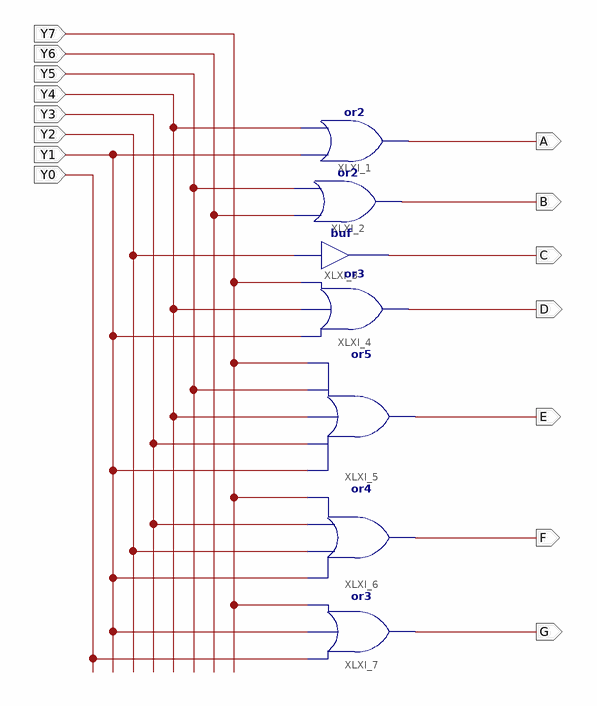
[diagram p0: schematic sheet 1]
// Xilinx ISE schematic seven_segment_decoder.sch (zynq) as structural Verilog: 7 symbols, 15 ports
module seven_segment_decoder (
  input  Y7,
  input  Y6,
  input  Y4,
  input  Y3,
  input  Y2,
  input  Y1,
  input  Y0,
  input  Y5,
  output A,
  output B,
  output C,
  output D,
  output E,
  output F,
  output G
);

  or XLXI_1 (A, Y1, Y4);
  or XLXI_2 (B, Y6, Y5);
  buf XLXI_3 (C, Y2);
  or XLXI_4 (D, Y1, Y4, Y7);
  or XLXI_5 (E, Y1, Y3, Y4, Y5, Y7);
  or XLXI_6 (F, Y1, Y2, Y3, Y7);
  or XLXI_7 (G, Y0, Y1, Y7);
endmodule
